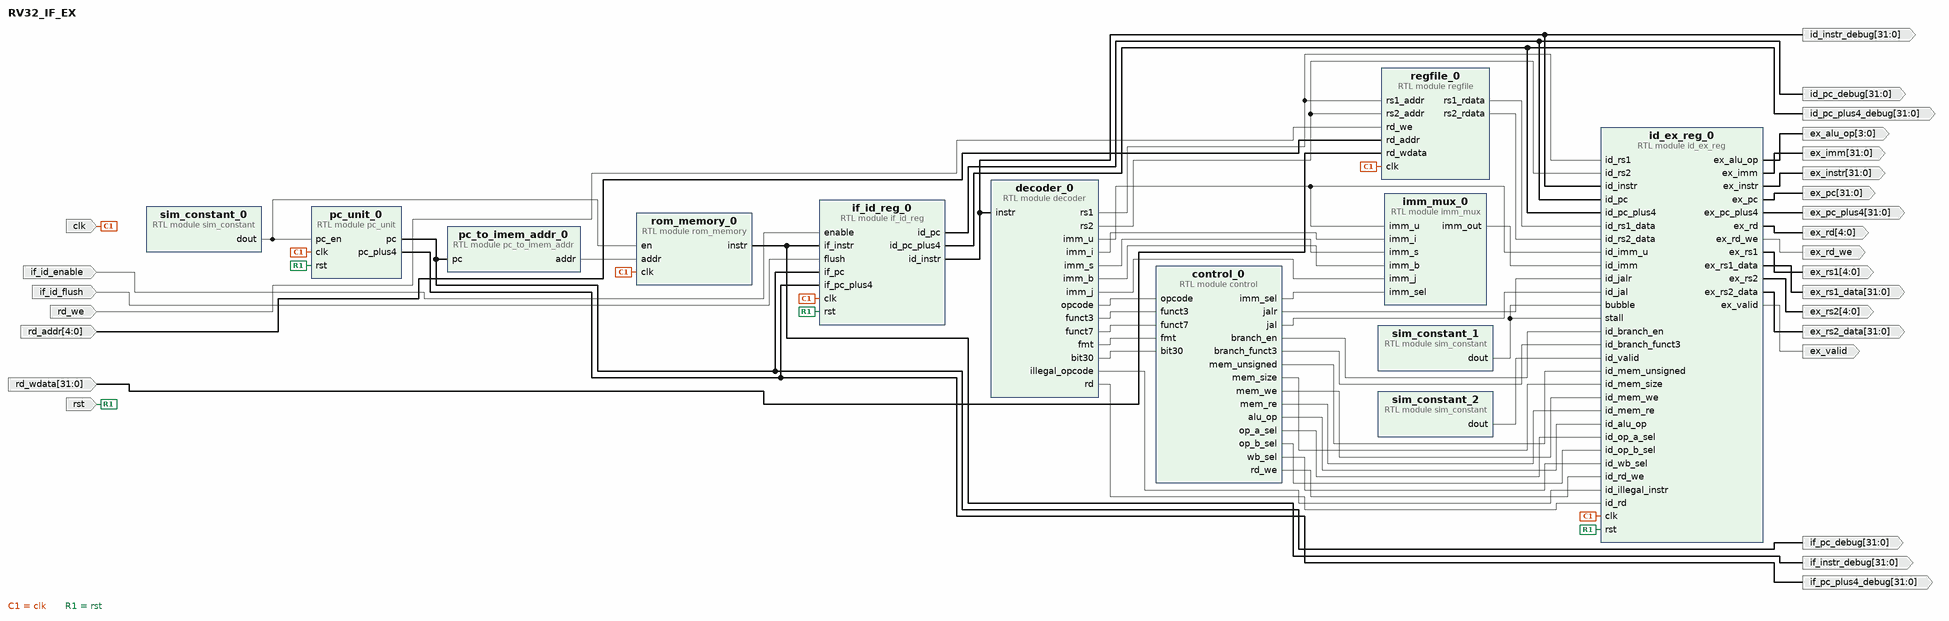
[diagram p0: block diagram of the top level]
# Vivado block design RV32_IF_EX, xczu5ev-sfvc784-2-i, Vivado 2020.1
create_bd_design RV32_IF_EX

create_bd_port -dir I clk
create_bd_port -dir O -from 31 -to 0 id_instr_debug
create_bd_port -dir O -from 31 -to 0 id_pc_debug
create_bd_port -dir O -from 31 -to 0 id_pc_plus4_debug
create_bd_port -dir I if_id_enable
create_bd_port -dir I if_id_flush
create_bd_port -dir O -from 31 -to 0 if_instr_debug
create_bd_port -dir O -from 31 -to 0 -type data if_pc_debug
create_bd_port -dir O -from 31 -to 0 if_pc_plus4_debug
create_bd_port -dir I -type rst rst
set_property -dict {CONFIG.POLARITY ACTIVE_HIGH} [get_bd_ports rst]
create_bd_port -dir I rd_we
create_bd_port -dir I -from 4 -to 0 rd_addr
create_bd_port -dir I -from 31 -to 0 rd_wdata
create_bd_port -dir O -from 31 -to 0 ex_pc
create_bd_port -dir O -from 31 -to 0 ex_pc_plus4
create_bd_port -dir O -from 31 -to 0 ex_rs1_data
create_bd_port -dir O -from 31 -to 0 ex_rs2_data
create_bd_port -dir O -from 31 -to 0 ex_imm
create_bd_port -dir O -from 4 -to 0 ex_rs1
create_bd_port -dir O -from 4 -to 0 ex_rs2
create_bd_port -dir O -from 4 -to 0 ex_rd
create_bd_port -dir O -from 3 -to 0 ex_alu_op
create_bd_port -dir O ex_rd_we
create_bd_port -dir O -from 31 -to 0 ex_instr
create_bd_port -dir O ex_valid

create_bd_cell -type module -reference if_id_reg if_id_reg_0
create_bd_cell -type module -reference pc_to_imem_addr pc_to_imem_addr_0
create_bd_cell -type module -reference pc_unit pc_unit_0
create_bd_cell -type module -reference rom_memory rom_memory_0
create_bd_cell -type module -reference sim_constant sim_constant_0
set_property -dict {CONFIG.VALUE 1} [get_bd_cells sim_constant_0]
create_bd_cell -type module -reference control control_0
create_bd_cell -type module -reference decoder decoder_0
create_bd_cell -type module -reference id_ex_reg id_ex_reg_0
create_bd_cell -type module -reference imm_mux imm_mux_0
create_bd_cell -type module -reference regfile regfile_0
create_bd_cell -type module -reference sim_constant sim_constant_1
set_property -dict {CONFIG.VALUE 0} [get_bd_cells sim_constant_1]
create_bd_cell -type module -reference sim_constant sim_constant_2
set_property -dict {CONFIG.VALUE 1} [get_bd_cells sim_constant_2]

# ---- connections ----

connect_bd_net [get_bd_ports clk] \
  [get_bd_pins pc_unit_0/clk] [get_bd_pins rom_memory_0/clk] [get_bd_pins if_id_reg_0/clk] [get_bd_pins regfile_0/clk] \
  [get_bd_pins id_ex_reg_0/clk]
connect_bd_net [get_bd_pins sim_constant_0/dout] [get_bd_pins pc_unit_0/pc_en] [get_bd_pins rom_memory_0/en]
connect_bd_net [get_bd_ports if_id_enable] [get_bd_pins if_id_reg_0/enable]
connect_bd_net [get_bd_ports if_id_flush] [get_bd_pins if_id_reg_0/flush]
connect_bd_net [get_bd_pins if_id_reg_0/id_instr] [get_bd_ports id_instr_debug] [get_bd_pins decoder_0/instr] [get_bd_pins id_ex_reg_0/id_instr]
connect_bd_net [get_bd_pins if_id_reg_0/id_pc] [get_bd_ports id_pc_debug] [get_bd_pins id_ex_reg_0/id_pc]
connect_bd_net [get_bd_pins if_id_reg_0/id_pc_plus4] [get_bd_ports id_pc_plus4_debug] [get_bd_pins id_ex_reg_0/id_pc_plus4]
connect_bd_net [get_bd_pins pc_to_imem_addr_0/addr] [get_bd_pins rom_memory_0/addr]
connect_bd_net [get_bd_pins pc_unit_0/pc] [get_bd_pins pc_to_imem_addr_0/pc] [get_bd_pins if_id_reg_0/if_pc] [get_bd_ports if_pc_debug]
connect_bd_net [get_bd_pins pc_unit_0/pc_plus4] [get_bd_pins if_id_reg_0/if_pc_plus4] [get_bd_ports if_pc_plus4_debug]
connect_bd_net [get_bd_pins rom_memory_0/instr] [get_bd_ports if_instr_debug] [get_bd_pins if_id_reg_0/if_instr]
connect_bd_net [get_bd_ports rst] [get_bd_pins pc_unit_0/rst] [get_bd_pins if_id_reg_0/rst] [get_bd_pins id_ex_reg_0/rst]
connect_bd_net [get_bd_pins decoder_0/opcode] [get_bd_pins control_0/opcode]
connect_bd_net [get_bd_pins decoder_0/funct3] [get_bd_pins control_0/funct3]
connect_bd_net [get_bd_pins decoder_0/funct7] [get_bd_pins control_0/funct7]
connect_bd_net [get_bd_pins decoder_0/fmt] [get_bd_pins control_0/fmt]
connect_bd_net [get_bd_pins decoder_0/bit30] [get_bd_pins control_0/bit30]
connect_bd_net [get_bd_pins decoder_0/rs1] [get_bd_pins regfile_0/rs1_addr] [get_bd_pins id_ex_reg_0/id_rs1]
connect_bd_net [get_bd_pins decoder_0/rs2] [get_bd_pins regfile_0/rs2_addr] [get_bd_pins id_ex_reg_0/id_rs2]
connect_bd_net [get_bd_pins decoder_0/imm_i] [get_bd_pins imm_mux_0/imm_i]
connect_bd_net [get_bd_pins decoder_0/imm_s] [get_bd_pins imm_mux_0/imm_s]
connect_bd_net [get_bd_pins decoder_0/imm_b] [get_bd_pins imm_mux_0/imm_b]
connect_bd_net [get_bd_pins decoder_0/imm_u] [get_bd_pins imm_mux_0/imm_u] [get_bd_pins id_ex_reg_0/id_imm_u]
connect_bd_net [get_bd_pins decoder_0/imm_j] [get_bd_pins imm_mux_0/imm_j]
connect_bd_net [get_bd_pins control_0/imm_sel] [get_bd_pins imm_mux_0/imm_sel]
connect_bd_net [get_bd_pins regfile_0/rs1_rdata] [get_bd_pins id_ex_reg_0/id_rs1_data]
connect_bd_net [get_bd_pins regfile_0/rs2_rdata] [get_bd_pins id_ex_reg_0/id_rs2_data]
connect_bd_net [get_bd_pins control_0/jalr] [get_bd_pins id_ex_reg_0/id_jalr]
connect_bd_net [get_bd_pins control_0/jal] [get_bd_pins id_ex_reg_0/id_jal]
connect_bd_net [get_bd_pins control_0/branch_en] [get_bd_pins id_ex_reg_0/id_branch_en]
connect_bd_net [get_bd_pins control_0/branch_funct3] [get_bd_pins id_ex_reg_0/id_branch_funct3]
connect_bd_net [get_bd_pins control_0/mem_unsigned] [get_bd_pins id_ex_reg_0/id_mem_unsigned]
connect_bd_net [get_bd_pins control_0/mem_size] [get_bd_pins id_ex_reg_0/id_mem_size]
connect_bd_net [get_bd_pins control_0/mem_we] [get_bd_pins id_ex_reg_0/id_mem_we]
connect_bd_net [get_bd_pins control_0/mem_re] [get_bd_pins id_ex_reg_0/id_mem_re]
connect_bd_net [get_bd_pins control_0/alu_op] [get_bd_pins id_ex_reg_0/id_alu_op]
connect_bd_net [get_bd_pins control_0/op_a_sel] [get_bd_pins id_ex_reg_0/id_op_a_sel]
connect_bd_net [get_bd_pins control_0/op_b_sel] [get_bd_pins id_ex_reg_0/id_op_b_sel]
connect_bd_net [get_bd_pins control_0/wb_sel] [get_bd_pins id_ex_reg_0/id_wb_sel]
connect_bd_net [get_bd_pins control_0/rd_we] [get_bd_pins id_ex_reg_0/id_rd_we]
connect_bd_net [get_bd_pins imm_mux_0/imm_out] [get_bd_pins id_ex_reg_0/id_imm]
connect_bd_net [get_bd_ports rd_we] [get_bd_pins regfile_0/rd_we]
connect_bd_net [get_bd_ports rd_addr] [get_bd_pins regfile_0/rd_addr]
connect_bd_net [get_bd_ports rd_wdata] [get_bd_pins regfile_0/rd_wdata]
connect_bd_net [get_bd_pins sim_constant_1/dout] [get_bd_pins id_ex_reg_0/stall] [get_bd_pins id_ex_reg_0/bubble]
connect_bd_net [get_bd_pins sim_constant_2/dout] [get_bd_pins id_ex_reg_0/id_valid]
connect_bd_net [get_bd_pins decoder_0/illegal_opcode] [get_bd_pins id_ex_reg_0/id_illegal_instr]
connect_bd_net [get_bd_pins decoder_0/rd] [get_bd_pins id_ex_reg_0/id_rd]
connect_bd_net [get_bd_pins id_ex_reg_0/ex_pc] [get_bd_ports ex_pc]
connect_bd_net [get_bd_pins id_ex_reg_0/ex_pc_plus4] [get_bd_ports ex_pc_plus4]
connect_bd_net [get_bd_pins id_ex_reg_0/ex_rs1_data] [get_bd_ports ex_rs1_data]
connect_bd_net [get_bd_pins id_ex_reg_0/ex_rs2_data] [get_bd_ports ex_rs2_data]
connect_bd_net [get_bd_pins id_ex_reg_0/ex_imm] [get_bd_ports ex_imm]
connect_bd_net [get_bd_pins id_ex_reg_0/ex_rs1] [get_bd_ports ex_rs1]
connect_bd_net [get_bd_pins id_ex_reg_0/ex_rs2] [get_bd_ports ex_rs2]
connect_bd_net [get_bd_pins id_ex_reg_0/ex_rd] [get_bd_ports ex_rd]
connect_bd_net [get_bd_pins id_ex_reg_0/ex_alu_op] [get_bd_ports ex_alu_op]
connect_bd_net [get_bd_pins id_ex_reg_0/ex_rd_we] [get_bd_ports ex_rd_we]
connect_bd_net [get_bd_pins id_ex_reg_0/ex_instr] [get_bd_ports ex_instr]
connect_bd_net [get_bd_pins id_ex_reg_0/ex_valid] [get_bd_ports ex_valid]

validate_bd_design
save_bd_design
